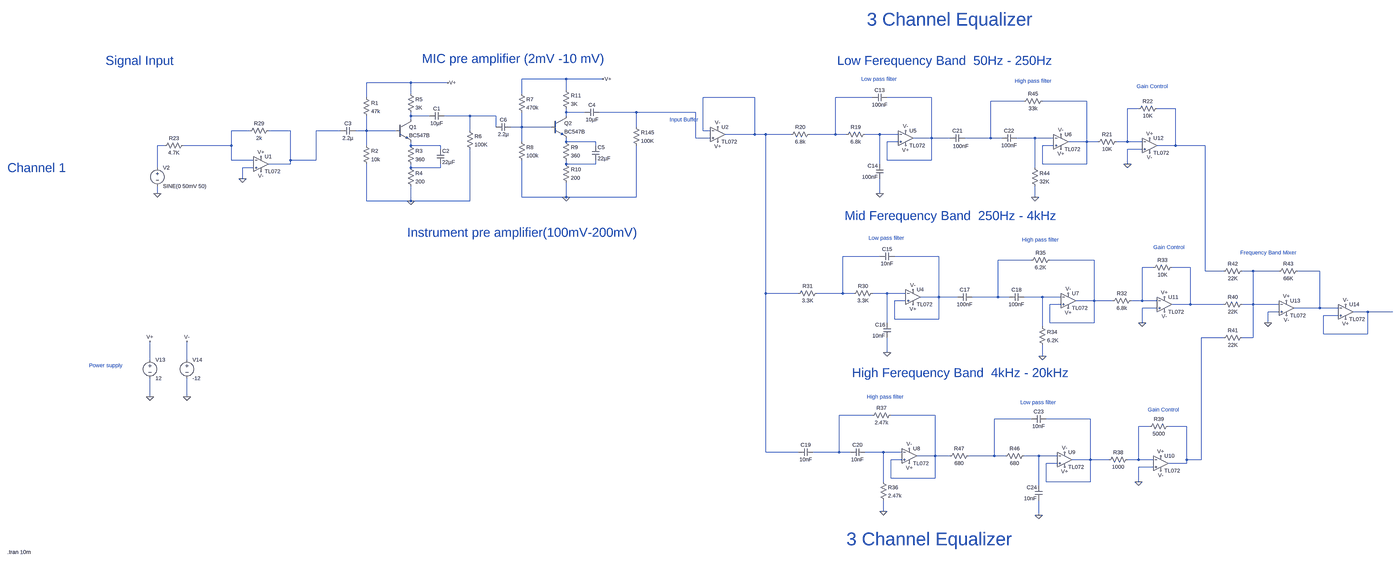
[diagram p0: schematic Simulation.asc, whole sheet]
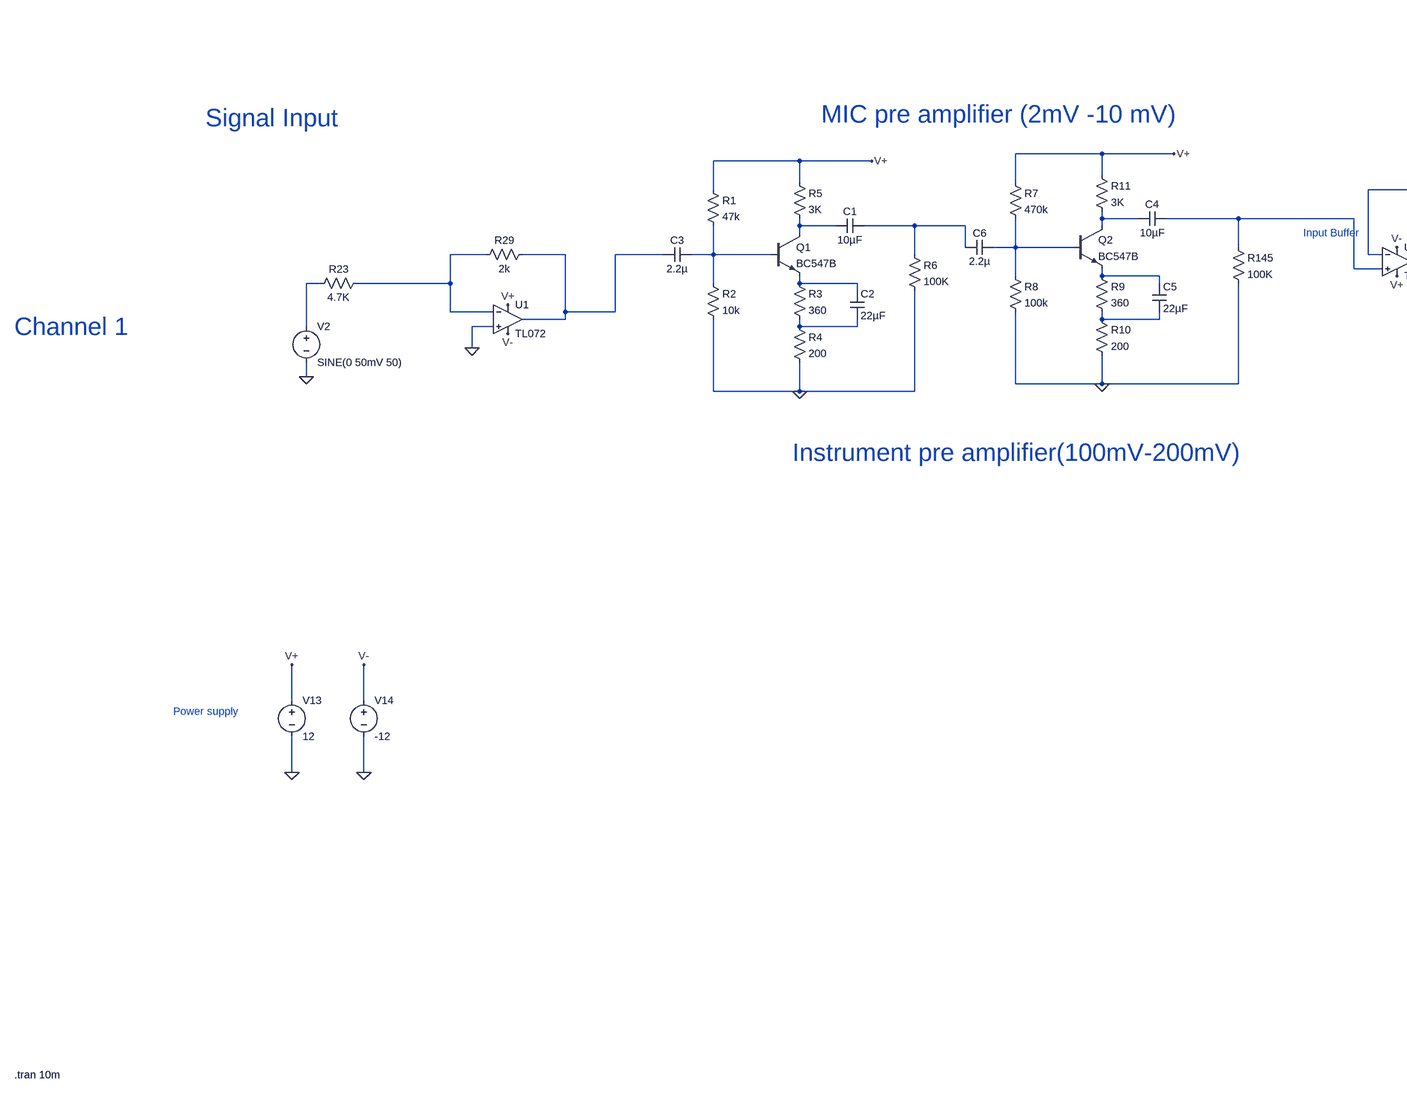
[diagram p1: schematic Simulation.asc, part, row 1 of 1, column 1 of 2]
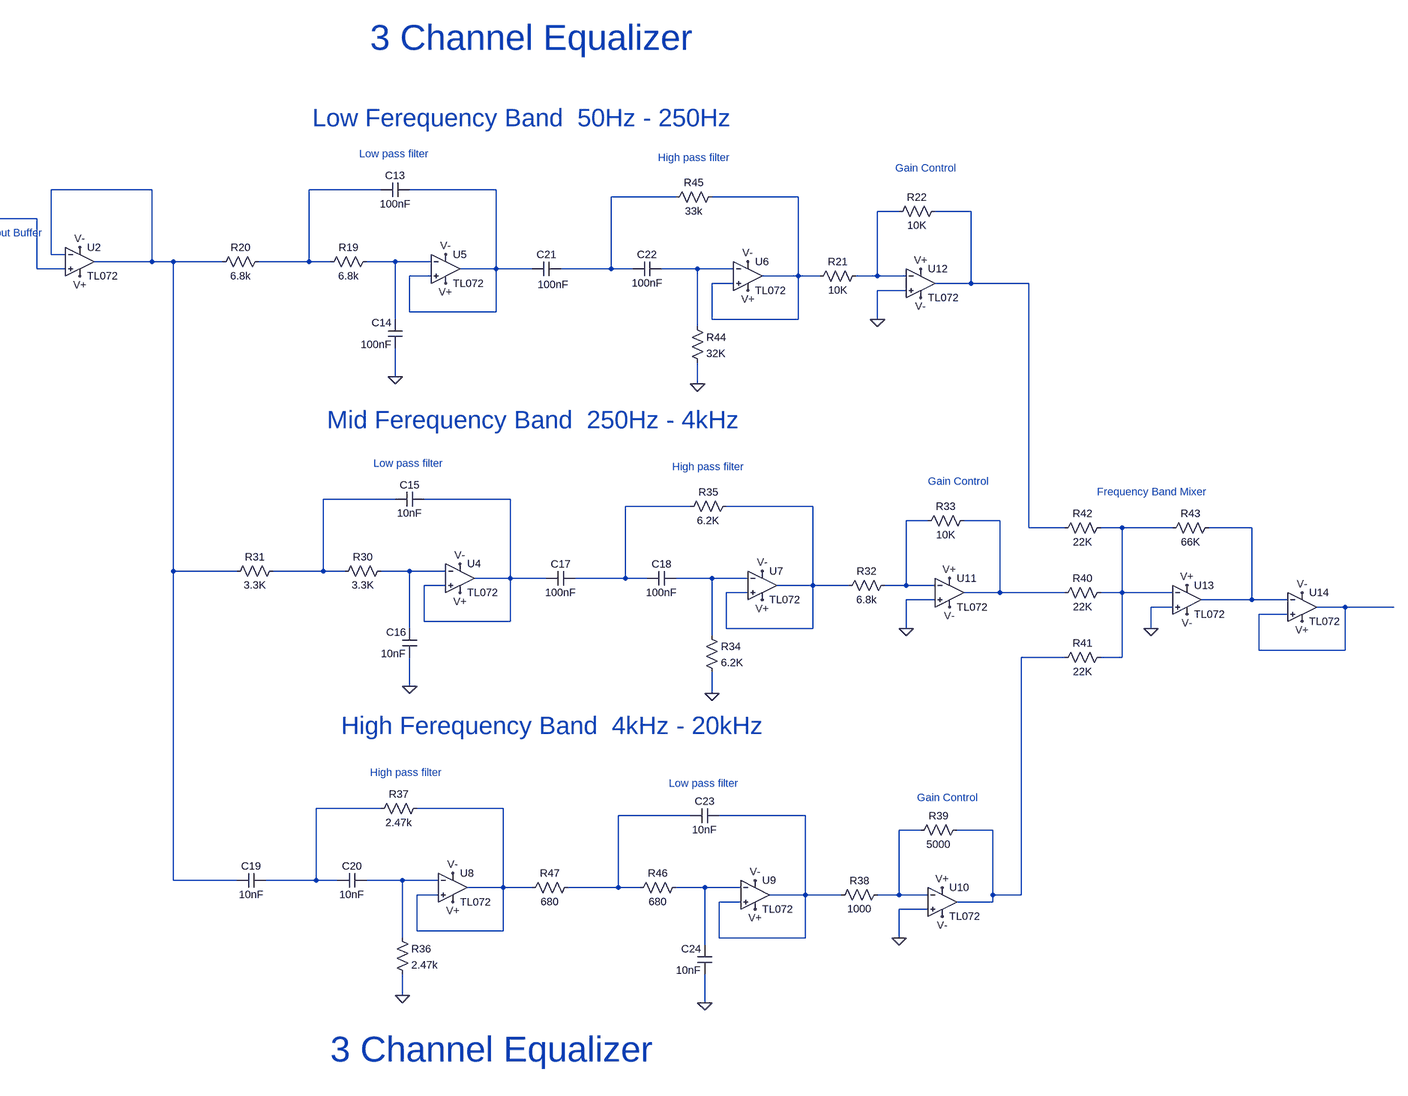
[diagram p2: schematic Simulation.asc, part, row 1 of 1, column 2 of 2]
Simulation.asc, the LTspice schematic file:
Version 4.1
SHEET 1 6248 6468
WIRE 448 -160 256 -160
WIRE 608 -160 448 -160
WIRE -224 -144 -416 -144
WIRE -64 -144 -224 -144
WIRE 448 -112 448 -160
WIRE -224 -96 -224 -144
WIRE 256 -96 256 -160
WIRE -416 -80 -416 -144
WIRE 1264 -80 1040 -80
WIRE 1808 -80 1648 -80
WIRE 2064 -80 1872 -80
WIRE 2464 -64 2320 -64
WIRE 2736 -64 2544 -64
WIRE 2960 -32 2912 -32
WIRE 3120 -32 3040 -32
WIRE 448 -16 448 -32
WIRE 528 -16 448 -16
WIRE 752 -16 592 -16
WIRE 1008 -16 752 -16
WIRE -224 0 -224 -16
WIRE -144 0 -224 0
WIRE 32 0 -80 0
WIRE 144 0 32 0
WIRE 448 0 448 -16
WIRE -224 16 -224 0
WIRE 144 48 144 0
WIRE 256 48 256 -16
WIRE 256 48 208 48
WIRE 384 48 256 48
WIRE 752 48 752 -16
WIRE -1264 64 -1344 64
WIRE -1088 64 -1184 64
WIRE -528 64 -704 64
WIRE -416 64 -416 0
WIRE -416 64 -464 64
WIRE -288 64 -416 64
WIRE 32 64 32 0
WIRE 1040 64 1040 -80
WIRE 1072 64 1040 64
WIRE 1264 80 1264 -80
WIRE 1264 80 1136 80
WIRE 1312 80 1264 80
WIRE 1456 80 1312 80
WIRE 1648 80 1648 -80
WIRE 1648 80 1536 80
WIRE 1696 80 1648 80
WIRE 1840 80 1776 80
WIRE 1920 80 1840 80
WIRE 1008 96 1008 -16
WIRE 1072 96 1008 96
WIRE 2064 96 2064 -80
WIRE 2064 96 1984 96
WIRE 2144 96 2064 96
WIRE 2320 96 2320 -64
WIRE 2320 96 2208 96
WIRE 2368 96 2320 96
WIRE 2512 96 2432 96
WIRE 2592 96 2512 96
WIRE 256 112 256 48
WIRE 448 112 448 96
WIRE 576 112 448 112
WIRE 1920 112 1872 112
WIRE 2736 112 2736 -64
WIRE 2736 112 2656 112
WIRE 2784 112 2736 112
WIRE 2912 112 2912 -32
WIRE 2912 112 2864 112
WIRE 2976 112 2912 112
WIRE -1824 128 -1856 128
WIRE -1344 128 -1344 64
WIRE -1344 128 -1744 128
WIRE -416 128 -416 64
WIRE -224 128 -224 112
WIRE -96 128 -224 128
WIRE 576 128 576 112
WIRE 2592 128 2544 128
WIRE 3120 128 3120 -32
WIRE 3120 128 3040 128
WIRE 3248 128 3120 128
WIRE -96 144 -96 128
WIRE 2976 144 2912 144
WIRE -1344 192 -1344 128
WIRE -1248 192 -1344 192
WIRE -1088 192 -1088 64
WIRE -704 192 -704 64
WIRE -704 192 -1088 192
WIRE 1872 192 1872 112
WIRE 2064 192 2064 96
WIRE 2064 192 1872 192
WIRE -1088 208 -1088 192
WIRE -1088 208 -1184 208
WIRE 448 208 448 192
WIRE 576 208 576 192
WIRE 576 208 448 208
WIRE 1840 208 1840 80
WIRE 2544 208 2544 128
WIRE 2736 208 2736 112
WIRE 2736 208 2544 208
WIRE 2912 208 2912 144
WIRE -1856 224 -1856 128
WIRE -1248 224 -1296 224
WIRE -224 224 -224 208
WIRE -96 224 -96 208
WIRE -96 224 -224 224
WIRE 2512 224 2512 96
WIRE -1296 272 -1296 224
WIRE -1856 336 -1856 304
WIRE 1840 336 1840 272
WIRE 256 352 256 192
WIRE 448 352 448 288
WIRE 448 352 256 352
WIRE 752 352 752 128
WIRE 752 352 448 352
WIRE 2512 352 2512 304
WIRE -416 368 -416 208
WIRE -224 368 -224 304
WIRE -224 368 -416 368
WIRE 32 368 32 144
WIRE 32 368 -224 368
WIRE 1840 608 1680 608
WIRE 2096 608 1904 608
WIRE 2496 624 2352 624
WIRE 2768 624 2576 624
WIRE 3024 656 2976 656
WIRE 3184 656 3104 656
WIRE 3248 672 3248 128
WIRE 3328 672 3248 672
WIRE 3456 672 3408 672
WIRE 3568 672 3456 672
WIRE 3744 672 3648 672
WIRE 1312 768 1312 80
WIRE 1488 768 1312 768
WIRE 1680 768 1680 608
WIRE 1680 768 1568 768
WIRE 1728 768 1680 768
WIRE 1872 768 1808 768
WIRE 1952 768 1872 768
WIRE 2096 784 2096 608
WIRE 2096 784 2016 784
WIRE 2176 784 2096 784
WIRE 2352 784 2352 624
WIRE 2352 784 2240 784
WIRE 2400 784 2352 784
WIRE 2544 784 2464 784
WIRE 2624 784 2544 784
WIRE 1952 800 1904 800
WIRE 2768 800 2768 624
WIRE 2768 800 2688 800
WIRE 2848 800 2768 800
WIRE 2976 800 2976 656
WIRE 2976 800 2928 800
WIRE 3040 800 2976 800
WIRE 2624 816 2576 816
WIRE 3184 816 3184 656
WIRE 3184 816 3104 816
WIRE 3328 816 3184 816
WIRE 3456 816 3456 672
WIRE 3456 816 3408 816
WIRE 3568 816 3456 816
WIRE 3040 832 2976 832
WIRE 3744 832 3744 672
WIRE 3744 832 3632 832
WIRE 3824 832 3744 832
WIRE 3568 848 3520 848
WIRE 3952 848 3888 848
WIRE 4160 848 3952 848
WIRE 3824 864 3760 864
WIRE 1904 880 1904 800
WIRE 2096 880 2096 784
WIRE 2096 880 1904 880
WIRE 1872 896 1872 768
WIRE 2576 896 2576 816
WIRE 2768 896 2768 800
WIRE 2768 896 2576 896
WIRE 2976 896 2976 832
WIRE 3520 896 3520 848
WIRE 2544 912 2544 784
WIRE 3760 944 3760 864
WIRE 3952 944 3952 848
WIRE 3952 944 3760 944
WIRE 3328 960 3232 960
WIRE 3456 960 3456 816
WIRE 3456 960 3408 960
WIRE 1872 1024 1872 960
WIRE 2544 1040 2544 992
WIRE -1888 1056 -1888 976
WIRE -1728 1056 -1728 976
WIRE -1888 1216 -1888 1136
WIRE -1728 1216 -1728 1136
WIRE 1808 1296 1664 1296
WIRE 2080 1296 1888 1296
WIRE 2496 1312 2336 1312
WIRE 2752 1312 2560 1312
WIRE 3008 1344 2960 1344
WIRE 3168 1344 3088 1344
WIRE 1312 1456 1312 768
WIRE 1488 1456 1312 1456
WIRE 1664 1456 1664 1296
WIRE 1664 1456 1552 1456
WIRE 1712 1456 1664 1456
WIRE 1856 1456 1776 1456
WIRE 1936 1456 1856 1456
WIRE 2080 1472 2080 1296
WIRE 2080 1472 2000 1472
WIRE 2144 1472 2080 1472
WIRE 2336 1472 2336 1312
WIRE 2336 1472 2224 1472
WIRE 2384 1472 2336 1472
WIRE 2528 1472 2464 1472
WIRE 2608 1472 2528 1472
WIRE 1936 1488 1888 1488
WIRE 2752 1488 2752 1312
WIRE 2752 1488 2672 1488
WIRE 2832 1488 2752 1488
WIRE 2960 1488 2960 1344
WIRE 2960 1488 2912 1488
WIRE 3024 1488 2960 1488
WIRE 3168 1488 3168 1344
WIRE 3232 1488 3232 960
WIRE 3232 1488 3168 1488
WIRE 2608 1504 2560 1504
WIRE 3168 1504 3168 1488
WIRE 3168 1504 3088 1504
WIRE 3024 1520 2960 1520
WIRE 1888 1568 1888 1488
WIRE 2080 1568 2080 1472
WIRE 2080 1568 1888 1568
WIRE 1856 1584 1856 1456
WIRE 2560 1584 2560 1504
WIRE 2752 1584 2752 1488
WIRE 2752 1584 2560 1584
WIRE 2960 1584 2960 1520
WIRE 2528 1600 2528 1472
WIRE 1856 1712 1856 1664
WIRE 2528 1728 2528 1664
FLAG -224 368 0
FLAG 448 352 0
FLAG 1840 336 0
FLAG 2912 208 0
FLAG -1296 272 0
FLAG 1872 1024 0
FLAG 2976 896 0
FLAG 2544 1040 0
FLAG 1856 1712 0
FLAG 2960 1584 0
FLAG 3520 896 0
FLAG -1888 1216 0
FLAG -1728 1216 0
FLAG -1888 976 V+
FLAG -1216 176 V+
FLAG 1104 112 V+
FLAG 1952 128 V+
FLAG 3008 96 V+
FLAG 1984 816 V+
FLAG 2656 832 V+
FLAG 3072 784 V+
FLAG 3600 800 V+
FLAG 3856 880 V+
FLAG 1968 1504 V+
FLAG 3056 1472 V+
FLAG -1728 976 V-
FLAG -1216 240 V-
FLAG 1104 48 V-
FLAG 1952 64 V-
FLAG 3008 160 V-
FLAG 1984 752 V-
FLAG 2656 768 V-
FLAG 3072 848 V-
FLAG 3600 864 V-
FLAG 3856 816 V-
FLAG 1968 1440 V-
FLAG 3056 1536 V-
FLAG 2512 352 0
FLAG 2624 144 V+
FLAG 2624 80 V-
FLAG 2528 1728 0
FLAG 2640 1520 V+
FLAG 2640 1456 V-
FLAG -64 -144 V+
FLAG 608 -160 V+
FLAG -1856 336 0
SYMBOL npn -288 16 R0
SYMATTR InstName Q1
SYMATTR Value BC547B
SYMBOL res -432 -96 R0
SYMATTR InstName R1
SYMATTR Value 47k
SYMBOL res -432 112 R0
SYMATTR InstName R2
SYMATTR Value 10k
SYMBOL res -240 112 R0
SYMATTR InstName R3
SYMATTR Value 360
SYMBOL res -240 208 R0
SYMATTR InstName R4
SYMATTR Value 200
SYMBOL res -240 -112 R0
SYMATTR InstName R5
SYMATTR Value 3K
SYMBOL cap -80 -16 R90
WINDOW 0 0 32 VBottom 2
WINDOW 3 32 32 VTop 2
SYMATTR InstName C1
SYMATTR Value 10µF
SYMBOL cap -112 144 R0
SYMATTR InstName C2
SYMATTR Value 22µF
SYMBOL cap -464 48 R90
WINDOW 0 0 32 VBottom 2
WINDOW 3 32 32 VTop 2
SYMATTR InstName C3
SYMATTR Value 2.2µ
SYMBOL res 16 48 R0
SYMATTR InstName R6
SYMATTR Value 100K
SYMBOL npn 384 0 R0
SYMATTR InstName Q2
SYMATTR Value BC547B
SYMBOL res 240 -112 R0
SYMATTR InstName R7
SYMATTR Value 470k
SYMBOL res 240 96 R0
SYMATTR InstName R8
SYMATTR Value 100k
SYMBOL res 432 96 R0
SYMATTR InstName R9
SYMATTR Value 360
SYMBOL res 432 192 R0
SYMATTR InstName R10
SYMATTR Value 200
SYMBOL res 432 -128 R0
SYMATTR InstName R11
SYMATTR Value 3K
SYMBOL cap 592 -32 R90
WINDOW 0 0 32 VBottom 2
WINDOW 3 32 32 VTop 2
SYMATTR InstName C4
SYMATTR Value 10µF
SYMBOL cap 560 128 R0
SYMATTR InstName C5
SYMATTR Value 22µF
SYMBOL cap 208 32 R90
WINDOW 0 0 32 VBottom 2
WINDOW 3 32 32 VTop 2
SYMATTR InstName C6
SYMATTR Value 2.2µ
SYMBOL res 1680 96 R270
WINDOW 0 32 56 VTop 2
WINDOW 3 0 56 VBottom 2
SYMATTR InstName R19
SYMATTR Value 6.8k
SYMBOL res 1440 96 R270
WINDOW 0 32 56 VTop 2
WINDOW 3 0 56 VBottom 2
SYMATTR InstName R20
SYMATTR Value 6.8k
SYMBOL cap 1872 -96 R90
WINDOW 0 0 32 VBottom 2
WINDOW 3 32 32 VTop 2
SYMATTR InstName C13
SYMATTR Value 100nF
SYMBOL cap 1856 272 R180
WINDOW 0 24 56 Left 2
WINDOW 3 24 8 Left 2
SYMATTR InstName C14
SYMATTR Value 100nF
SYMBOL res 2880 96 R90
WINDOW 0 0 56 VBottom 2
WINDOW 3 32 56 VTop 2
SYMATTR InstName R21
SYMATTR Value 10K
SYMBOL res 3056 -48 R90
WINDOW 0 0 56 VBottom 2
WINDOW 3 32 56 VTop 2
SYMATTR InstName R22
SYMATTR Value 10K
SYMBOL res -1168 48 R90
WINDOW 0 0 56 VBottom 2
WINDOW 3 32 56 VTop 2
SYMATTR InstName R29
SYMATTR Value 2k
SYMBOL res 1712 784 R270
WINDOW 0 32 56 VTop 2
WINDOW 3 0 56 VBottom 2
SYMATTR InstName R30
SYMATTR Value 3.3K
SYMBOL res 1472 784 R270
WINDOW 0 32 56 VTop 2
WINDOW 3 0 56 VBottom 2
SYMATTR InstName R31
SYMATTR Value 3.3K
SYMBOL cap 1904 592 R90
WINDOW 0 0 32 VBottom 2
WINDOW 3 32 32 VTop 2
SYMATTR InstName C15
SYMATTR Value 10nF
SYMBOL cap 1888 960 R180
WINDOW 0 24 56 Left 2
WINDOW 3 24 8 Left 2
SYMATTR InstName C16
SYMATTR Value 10nF
SYMBOL res 2944 784 R90
WINDOW 0 0 56 VBottom 2
WINDOW 3 32 56 VTop 2
SYMATTR InstName R32
SYMATTR Value 6.8k
SYMBOL res 3120 640 R90
WINDOW 0 0 56 VBottom 2
WINDOW 3 32 56 VTop 2
SYMATTR InstName R33
SYMATTR Value 10K
SYMBOL res 2528 896 R0
SYMATTR InstName R34
SYMATTR Value 6.2K
SYMBOL res 2480 640 R270
WINDOW 0 32 56 VTop 2
WINDOW 3 0 56 VBottom 2
SYMATTR InstName R35
SYMATTR Value 6.2K
SYMBOL cap 2240 768 R90
WINDOW 0 0 32 VBottom 2
WINDOW 3 32 32 VTop 2
SYMATTR InstName C17
SYMATTR Value 100nF
SYMBOL cap 2400 800 R270
WINDOW 0 32 32 VTop 2
WINDOW 3 0 32 VBottom 2
SYMATTR InstName C18
SYMATTR Value 100nF
SYMBOL res 1840 1568 R0
SYMATTR InstName R36
SYMATTR Value 2.47k
SYMBOL res 1792 1312 R270
WINDOW 0 32 56 VTop 2
WINDOW 3 0 56 VBottom 2
SYMATTR InstName R37
SYMATTR Value 2.47k
SYMBOL cap 1552 1440 R90
WINDOW 0 0 32 VBottom 2
WINDOW 3 32 32 VTop 2
SYMATTR InstName C19
SYMATTR Value 10nF
SYMBOL cap 1712 1472 R270
WINDOW 0 32 32 VTop 2
WINDOW 3 0 32 VBottom 2
SYMATTR InstName C20
SYMATTR Value 10nF
SYMBOL res 2928 1472 R90
WINDOW 0 0 56 VBottom 2
WINDOW 3 32 56 VTop 2
SYMATTR InstName R38
SYMATTR Value 1000
SYMBOL res 3104 1328 R90
WINDOW 0 0 56 VBottom 2
WINDOW 3 32 56 VTop 2
SYMATTR InstName R39
SYMATTR Value 5000
SYMBOL res 3424 800 R90
WINDOW 0 0 56 VBottom 2
WINDOW 3 32 56 VTop 2
SYMATTR InstName R40
SYMATTR Value 22K
SYMBOL res 3424 944 R90
WINDOW 0 0 56 VBottom 2
WINDOW 3 32 56 VTop 2
SYMATTR InstName R41
SYMATTR Value 22K
SYMBOL res 3424 656 R90
WINDOW 0 0 56 VBottom 2
WINDOW 3 32 56 VTop 2
SYMATTR InstName R42
SYMATTR Value 22K
SYMBOL res 3664 656 R90
WINDOW 0 0 56 VBottom 2
WINDOW 3 32 56 VTop 2
SYMATTR InstName R43
SYMATTR Value 66K
SYMBOL voltage -1888 1040 R0
WINDOW 123 0 0 Left 0
WINDOW 39 0 0 Left 0
SYMATTR InstName V13
SYMATTR Value 12
SYMBOL voltage -1728 1040 R0
WINDOW 123 0 0 Left 0
WINDOW 39 0 0 Left 0
SYMATTR InstName V14
SYMATTR Value -12
SYMBOL res 2496 208 R0
SYMATTR InstName R44
SYMATTR Value 32K
SYMBOL res 2448 -48 R270
WINDOW 0 32 56 VTop 2
WINDOW 3 0 56 VBottom 2
SYMATTR InstName R45
SYMATTR Value 33k
SYMBOL cap 2208 80 R90
WINDOW 0 0 32 VBottom 2
WINDOW 3 35 17 VTop 2
SYMATTR InstName C21
SYMATTR Value 100nF
SYMBOL cap 2368 112 R270
WINDOW 0 32 32 VTop 2
WINDOW 3 0 32 VBottom 2
SYMATTR InstName C22
SYMATTR Value 100nF
SYMBOL res 2368 1488 R270
WINDOW 0 32 56 VTop 2
WINDOW 3 0 56 VBottom 2
SYMATTR InstName R46
SYMATTR Value 680
SYMBOL res 2128 1488 R270
WINDOW 0 32 56 VTop 2
WINDOW 3 0 56 VBottom 2
SYMATTR InstName R47
SYMATTR Value 680
SYMBOL cap 2560 1296 R90
WINDOW 0 0 32 VBottom 2
WINDOW 3 32 32 VTop 2
SYMATTR InstName C23
SYMATTR Value 10nF
SYMBOL cap 2544 1664 R180
WINDOW 0 24 56 Left 2
WINDOW 3 24 8 Left 2
SYMATTR InstName C24
SYMATTR Value 10nF
SYMBOL res 736 32 R0
SYMATTR InstName R145
SYMATTR Value 100K
SYMBOL voltage -1856 208 R0
WINDOW 123 0 0 Left 0
WINDOW 39 0 0 Left 0
SYMATTR InstName V2
SYMATTR Value SINE(0 50mV 50)
SYMBOL res -1728 112 R90
WINDOW 0 0 56 VBottom 2
WINDOW 3 32 56 VTop 2
SYMATTR InstName R23
SYMATTR Value 4.7K
SYMBOL OpAmps\\TL072 -1216 144 R0
SYMATTR InstName U1
SYMBOL OpAmps\\TL072 1104 16 R0
SYMATTR InstName U2
SYMBOL OpAmps\\TL072 1984 720 R0
SYMATTR InstName U4
SYMBOL OpAmps\\TL072 1952 32 R0
SYMATTR InstName U5
SYMBOL OpAmps\\TL072 2624 48 R0
SYMATTR InstName U6
SYMBOL OpAmps\\TL072 2656 736 R0
SYMATTR InstName U7
SYMBOL OpAmps\\TL072 1968 1408 R0
SYMATTR InstName U8
SYMBOL OpAmps\\TL072 2640 1424 R0
SYMATTR InstName U9
SYMBOL OpAmps\\TL072 3056 1440 R0
SYMATTR InstName U10
SYMBOL OpAmps\\TL072 3072 752 R0
SYMATTR InstName U11
SYMBOL OpAmps\\TL072 3008 64 R0
SYMATTR InstName U12
SYMBOL OpAmps\\TL072 3600 768 R0
SYMATTR InstName U13
SYMBOL OpAmps\\TL072 3856 784 R0
SYMATTR InstName U14
TEXT -2080 -240 Left 5 ;Signal Input
TEXT 1760 -160 Left 2 ;Low pass filter
TEXT 2952 -128 Left 2 ;Gain Control
TEXT 1656 -240 Left 5 ;Low Ferequency Band  50Hz - 250Hz
TEXT 1792 528 Left 2 ;Low pass filter
TEXT 3024 568 Left 2 ;Gain Control
TEXT 1688 432 Left 5 ;Mid Ferequency Band  250Hz - 4kHz
TEXT 2456 536 Left 2 ;High pass filter
TEXT 1784 1216 Left 2 ;High pass filter
TEXT 3000 1272 Left 2 ;Gain Control
TEXT 1720 1112 Left 5 ;High Ferequency Band  4kHz - 20kHz
TEXT 896 16 Left 2 ;Input Buffer
TEXT 1784 -528 Left 6 ;3 Channel Equalizer
TEXT 3400 592 Left 2 ;Frequency Band Mixer
TEXT 2424 -152 Left 2 ;High pass filter
TEXT 2448 1240 Left 2 ;Low pass filter
TEXT -176 -248 Left 5 ;MIC pre amplifier (2mV -10 mV)
TEXT -240 504 Left 5 ;Instrument pre amplifier(100mV-200mV)
TEXT -2840 224 Left 5 ;Channel 1
TEXT -2152 1080 Left 2 ;Power supply
TEXT 1696 1832 Left 6 ;3 Channel Equalizer
TEXT -2840 1888 Left 2 !.tran 10m

The netlist it stands for:
* Simulation.asc
Q1 N010 N015 N020 0 BC547B
R1 V+ N015 47k
R2 N015 0 10k
R3 N020 N022 360
R4 N022 0 200
R5 V+ N010 3K
C1 N011 N010 10µF
C2 N020 N022 22µF
C3 N015 N014 2.2µ
R6 N011 0 100K
Q2 N008 N012 N018 0 BC547B
R7 V+ N012 470k
R8 N012 0 100k
R9 N018 N021 360
R10 N021 0 200
R11 V+ N008 3K
C4 N009 N008 10µF
C5 N018 N021 22µF
C6 N012 N011 2.2µ
R19 N002 N016 6.8k
R20 N001 N002 6.8k
C13 N003 N002 100nF
C14 0 N016 100nF
R21 N006 N005 10K
R22 N007 N006 10K
R29 N014 N013 2k
R30 N023 N031 3.3K
R31 N001 N023 3.3K
C15 N024 N023 10nF
C16 0 N031 10nF
R32 N027 N026 6.8k
R33 N028 N027 10K
R34 N032 0 6.2K
R35 N025 N026 6.2K
C17 N025 N024 100nF
C18 N025 N032 100nF
R36 N040 0 2.47k
R37 N035 N036 2.47k
C19 N035 N001 10nF
C20 N035 N040 10nF
R38 N039 N038 1000
R39 N034 N039 5000
R40 N029 N028 22K
R41 N029 N034 22K
R42 N029 N007 22K
R43 N030 N029 66K
V13 V+ 0 12
V14 V- 0 -12
R44 N017 0 32K
R45 N004 N005 33k
C21 N004 N003 100nF
C22 N004 N017 100nF
R46 N037 N041 680
R47 N036 N037 680
C23 N038 N037 10nF
C24 0 N041 10nF
R145 N009 0 100K
V2 N019 0 SINE(0 50mV 50)
R23 N013 N019 4.7K
X§U1 0 N013 V+ V- N014 TL072  ; pins In+ In- V+ V- OUT
X§U2 N009 N001 V- V+ N001 TL072  ; pins In+ In- V+ V- OUT
X§U4 N024 N031 V- V+ N024 TL072  ; pins In+ In- V+ V- OUT
X§U5 N003 N016 V- V+ N003 TL072  ; pins In+ In- V+ V- OUT
X§U6 N005 N017 V- V+ N005 TL072  ; pins In+ In- V+ V- OUT
X§U7 N026 N032 V- V+ N026 TL072  ; pins In+ In- V+ V- OUT
X§U8 N036 N040 V- V+ N036 TL072  ; pins In+ In- V+ V- OUT
X§U9 N038 N041 V- V+ N038 TL072  ; pins In+ In- V+ V- OUT
X§U10 0 N039 V+ V- N034 TL072  ; pins In+ In- V+ V- OUT
X§U11 0 N027 V+ V- N028 TL072  ; pins In+ In- V+ V- OUT
X§U12 0 N006 V+ V- N007 TL072  ; pins In+ In- V+ V- OUT
X§U13 0 N029 V+ V- N030 TL072  ; pins In+ In- V+ V- OUT
X§U14 N033 N030 V- V+ N033 TL072  ; pins In+ In- V+ V- OUT
.model NPN NPN
.model PNP PNP
.lib standard.bjt
* Signal Input
* Low pass filter
* Gain Control
* Low Ferequency Band  50Hz - 250Hz
* Low pass filter
* Gain Control
* Mid Ferequency Band  250Hz - 4kHz
* High pass filter
* High pass filter
* Gain Control
* High Ferequency Band  4kHz - 20kHz
* Input Buffer
* 3 Channel Equalizer
* Frequency Band Mixer
* High pass filter
* Low pass filter
* MIC pre amplifier (2mV -10 mV)
* Instrument pre amplifier(100mV-200mV)
* Channel 1
* Power supply
* 3 Channel Equalizer
.tran 10m
.backanno
.end